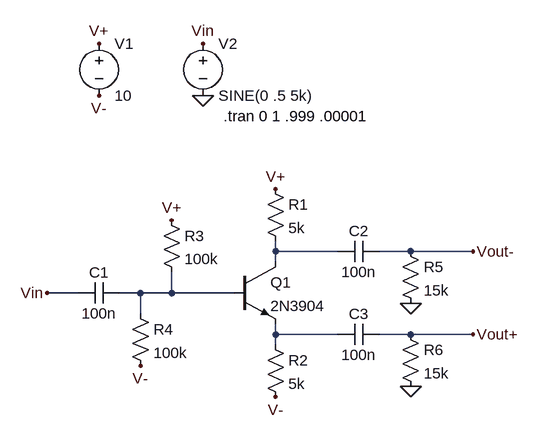
[diagram p0: schematic 04B-355.asc]
04B-355.asc, the LTspice schematic file:
Version 4.1
SHEET 1 888 680
WIRE 496 -80 496 -96
WIRE 592 -80 496 -80
WIRE 704 -80 656 -80
WIRE 800 -80 704 -80
WIRE 496 -64 496 -80
WIRE 192 -16 144 -16
WIRE 288 -16 256 -16
WIRE 336 -16 336 -48
WIRE 336 -16 288 -16
WIRE 432 -16 336 -16
WIRE 288 16 288 -16
WIRE 496 48 496 32
WIRE 592 48 496 48
WIRE 704 48 656 48
WIRE 800 48 704 48
WIRE 496 64 496 48
FLAG 144 -16 Vin
FLAG 800 48 Vout+
FLAG 800 -80 Vout-
FLAG 496 -176 V+
FLAG 336 -128 V+
FLAG 496 144 V-
FLAG 288 96 V-
FLAG 704 0 0
FLAG 704 128 0
FLAG 224 -400 V+
FLAG 224 -320 V-
FLAG 384 -320 0
FLAG 384 -400 Vin
SYMBOL npn 432 -64 R0
SYMATTR InstName Q1
SYMATTR Value 2N3904
SYMBOL res 480 -192 R0
SYMATTR InstName R1
SYMATTR Value 5k
SYMBOL res 480 48 R0
SYMATTR InstName R2
SYMATTR Value 5k
SYMBOL res 320 -144 R0
SYMATTR InstName R3
SYMATTR Value 100k
SYMBOL res 272 0 R0
SYMATTR InstName R4
SYMATTR Value 100k
SYMBOL cap 256 -32 R90
WINDOW 0 0 32 VBottom 2
WINDOW 3 32 32 VTop 2
SYMATTR InstName C1
SYMATTR Value 100n
SYMBOL cap 656 -96 R90
WINDOW 0 0 32 VBottom 2
WINDOW 3 32 32 VTop 2
SYMATTR InstName C2
SYMATTR Value 100n
SYMBOL cap 656 32 R90
WINDOW 0 0 32 VBottom 2
WINDOW 3 32 32 VTop 2
SYMATTR InstName C3
SYMATTR Value 100n
SYMBOL voltage 224 -416 R0
WINDOW 123 0 0 Left 0
WINDOW 39 0 0 Left 0
SYMATTR InstName V1
SYMATTR Value 10
SYMBOL res 688 -96 R0
SYMATTR InstName R5
SYMATTR Value 15k
SYMBOL res 688 32 R0
SYMATTR InstName R6
SYMATTR Value 15k
SYMBOL voltage 384 -416 R0
WINDOW 123 0 0 Left 0
WINDOW 39 0 0 Left 0
SYMATTR InstName V2
SYMATTR Value SINE(0 .5 5k)
TEXT 416 -288 Left 2 !.tran 0 1 .999 .00001

The netlist it stands for:
* 04B-355.asc
Q1 N001 N002 N003 0 2N3904
R1 V+ N001 5k
R2 N003 V- 5k
R3 V+ N002 100k
R4 N002 V- 100k
C1 N002 Vin 100n
C2 Vout- N001 100n
C3 Vout+ N003 100n
V1 V+ V- 10
R5 Vout- 0 15k
R6 Vout+ 0 15k
V2 Vin 0 SINE(0 .5 5k)
.model NPN NPN
.model PNP PNP
.lib standard.bjt
.tran 0 1 .999 .00001
.backanno
.end